# Altium project SynthyTwo.Project.PrjPcb
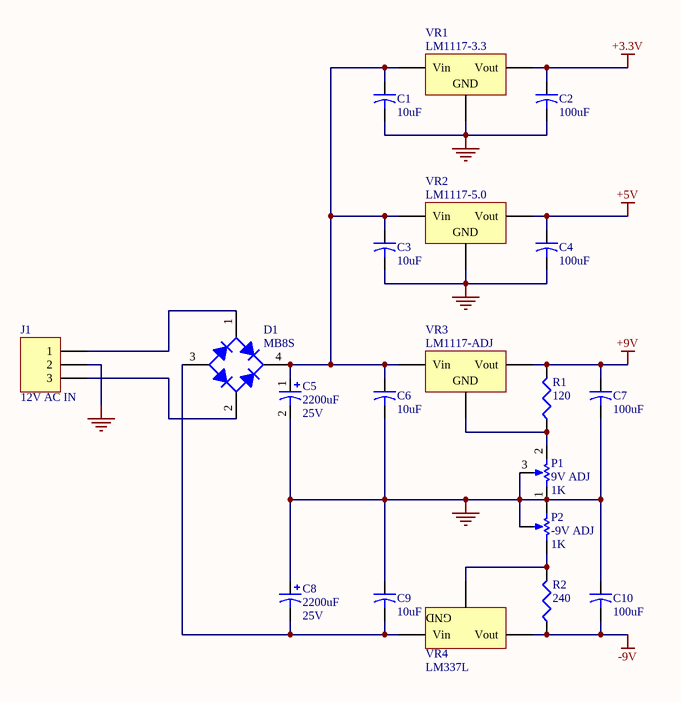
[diagram p0: PSU.Schematic.SchDoc]
7 sheets, 194 parts. Net scope: flat (ports and power ports of the same name join across sheets).
Board files: PCBROUTAGE.PcbDoc, PCBAdam.PcbDoc
Sheets:
  PSU.Schematic.SchDoc
  FilterBoard.Schematic.SchDoc
  Output.Schematic.SchDoc
  PIC.Schematic.SchDoc
  FilterControl.Schematic.SchDoc
  MIDI.Schematic.SchDoc
  Display.Schematic.SchDoc

## Sheet PSU.Schematic.SchDoc
size A

### Parts
C1  10uF  [CAPC1608N]
C2  100uF  [CAPC1608N]
C3  10uF  [CAPC1608N]
C4  100uF  [CAPC1608N]
C5  2200uF  value 25V  [Condo electro 13]
C6  10uF  [CAPC1608N]
C7  100uF  [CAPC1608N]
C8  2200uF  value 25V  [Condo electro 13]
C9  10uF  [CAPC1608N]
C10  100uF  [CAPC1608N]
D1  MB8S  [MB8S]
J1  12V AC IN  [HDR1X3]
P1  9V ADJ  value 1K  [BOURNS Trim pot]
P2  -9V ADJ  value 1K  [BOURNS Trim pot]
R1  120  [CAPC1608N]
R2  240  [CAPC1608N]
VR1  LM1117-3.3  [LM1117-SOT]
VR2  LM1117-5.0  [LM1117-SOT]
VR3  LM1117-ADJ  [LM1117-SOT]
VR4  LM337L  [LM337L]

### Nets
+3.3V: C2.1 VR1.3(Vout)
+5V: C4.1 VR2.3(Vout)
+9V: C7.1 R1.2 VR3.3(Vout)
-9V: C10.2 R2.1 VR4.3(Vout)
GND: C1.2 C2.2 C3.2 C4.2 C5.2 C6.2 C7.2 C8.1 C9.1 C10.1 J1.2 P1.1(TOP) P1.3(TAP) P2.2(BOT) P2.3(TAP) VR1.2(GND) VR2.2(GND)
NetC1_1: C1.1 C3.1 C5.1 C6.1 D1.4(K) VR1.1(Vin) VR2.1(Vin) VR3.1(Vin)
NetC8_2: C8.2 C9.2 D1.3(A) VR4.1(Vin)
NetD1_1: D1.1(C) J1.1
NetD1_2: D1.2(C) J1.3
NetP1_2: P1.2(BOT) R1.1 VR3.2(ADJ)
NetP2_1: P2.1(TOP) R2.2 VR4.2(ADJ)

### Notes on the sheet
- (in symbol Volt Reg) GND

### Library data of the parts
C1 C3 C6 C9 = Cap2: Capacitor; Value: 10u; Published: 23-Sep-2002; PackageReference: CAPR5-4X5; Publisher: Altium Limited; PackageDescription: Capacitor; 2 Leads
C2 C4 C7 C10 = Cap2: Capacitor; Value: 100u; Published: 23-Sep-2002; PackageReference: CAPR5-4X5; Publisher: Altium Limited; PackageDescription: Capacitor; 2 Leads
C5 C8 = Cap Pol1: Polarized Capacitor (Radial); Published: 8-Jun-2000; LatestRevisionDate: 17-Jul-2002; LatestRevisionNote: Re-released for DXP Platform.; PackageReference: RB7.6-15; Publisher: Altium Limited; PackageDescription: Polarized Capacitor (Radial); 2 Leads
D1 = Bridge1: Full Wave Diode Bridge; Fabricant: MULTICOMP; Published: 8-Jun-2000; LatestRevisionDate: 29-May-2009; LatestRevisionNote: Sch pins A & K swapped.; DatasheetVersion: E2732B; PackageReference: D-38; Publisher: Altium Limited; PackageDescription: Bridge Rectifier; 4 Terminals; Body 9.4 x 9.4 mm (typ); Pitch 5.08 mm; Datasheet: http://www.farnell.com/datasheets/1441729.pdf; Ref_Farnell: 1861520; Ref_Fabricant: MB8S
J1 = Header 3: Header, 3-Pin; Fabricant: Ideal Power; Ref_Fabricant: 77DE-06-12; LatestRevisionDate: 17-Jul-2002; LatestRevisionNote: Re-released for DXP Platform.; Publisher: Altium Limited; Datasheet: http://www.farnell.com/datasheets/1772938.pdf; Ref_Farnell: 2368013
P1 P2 = RPot: Potentiometer; Sim Note: Enter the Resistance value and the set point into parameter fields.; Set Position: 0.5; Published: 8-Jun-2000; LatestRevisionDate: 17-Jul-2002; LatestRevisionNote: Re-released for DXP Platform.; PackageReference: VR5; Publisher: Altium Limited; PackageDescription: Variable Resistor, Thru-Hole; 3 Leads
R1 R2 = Res3: Resistor; Published: 8-Jun-2000; LatestRevisionDate: 29-May-2009; LatestRevisionNote: IPC-7351 Footprint Added.; PackageReference: J1-0603; Publisher: Altium Limited; PackageDescription: Chip Resistor
  R1: Value: 120
  R2: Value: 240
VR1 = Volt Reg: Voltage Regulator; Ref_Fabricant: LM1117MPX-3.3/NOPB; Fabricant: Texas Instruments; Published: 24-Mar-1999; LatestRevisionDate: 29-May-2009; LatestRevisionNote: IPC-7351 Footprint Added.; PackageReference: D2PAK; Publisher: Altium Limited; PackageDescription: 3-Pin Transistor Outline Package 2.54 mm Pitch, 15.1 mm Lead Span; Ref_Farnell: 2323580; Datasheet: http://www.farnell.com/datasheets/2019100.pdf
VR2 = Volt Reg: Voltage Regulator; Ref_Fabricant: LM1117MPX-5.0/NOPB; Fabricant: Texas Instruments; Published: 24-Mar-1999; LatestRevisionDate: 29-May-2009; LatestRevisionNote: IPC-7351 Footprint Added.; PackageReference: D2PAK; Publisher: Altium Limited; PackageDescription: 3-Pin Transistor Outline Package 2.54 mm Pitch, 15.1 mm Lead Span; Datasheet: http://www.farnell.com/datasheets/2019100.pdf; Ref_Farnell: 2323572
VR3 = Volt Reg: Voltage Regulator; Published: 24-Mar-1999; LatestRevisionDate: 29-May-2009; LatestRevisionNote: IPC-7351 Footprint Added.; PackageReference: D2PAK; Publisher: Altium Limited; PackageDescription: 3-Pin Transistor Outline Package 2.54 mm Pitch, 15.1 mm Lead Span
VR4 = Volt Reg: Voltage Regulator; Fabricant: Texas Instruments; Ref_Fabricant: LM337LM/NOPB; Published: 24-Mar-1999; LatestRevisionDate: 29-May-2009; LatestRevisionNote: IPC-7351 Footprint Added.; PackageReference: D2PAK; Publisher: Altium Limited; PackageDescription: 3-Pin Transistor Outline Package 2.54 mm Pitch, 15.1 mm Lead Span; Ref_Farnell: 1469092; Datasheet: http://www.farnell.com/datasheets/1972825.pdf

## Sheet FilterBoard.Schematic.SchDoc
size B
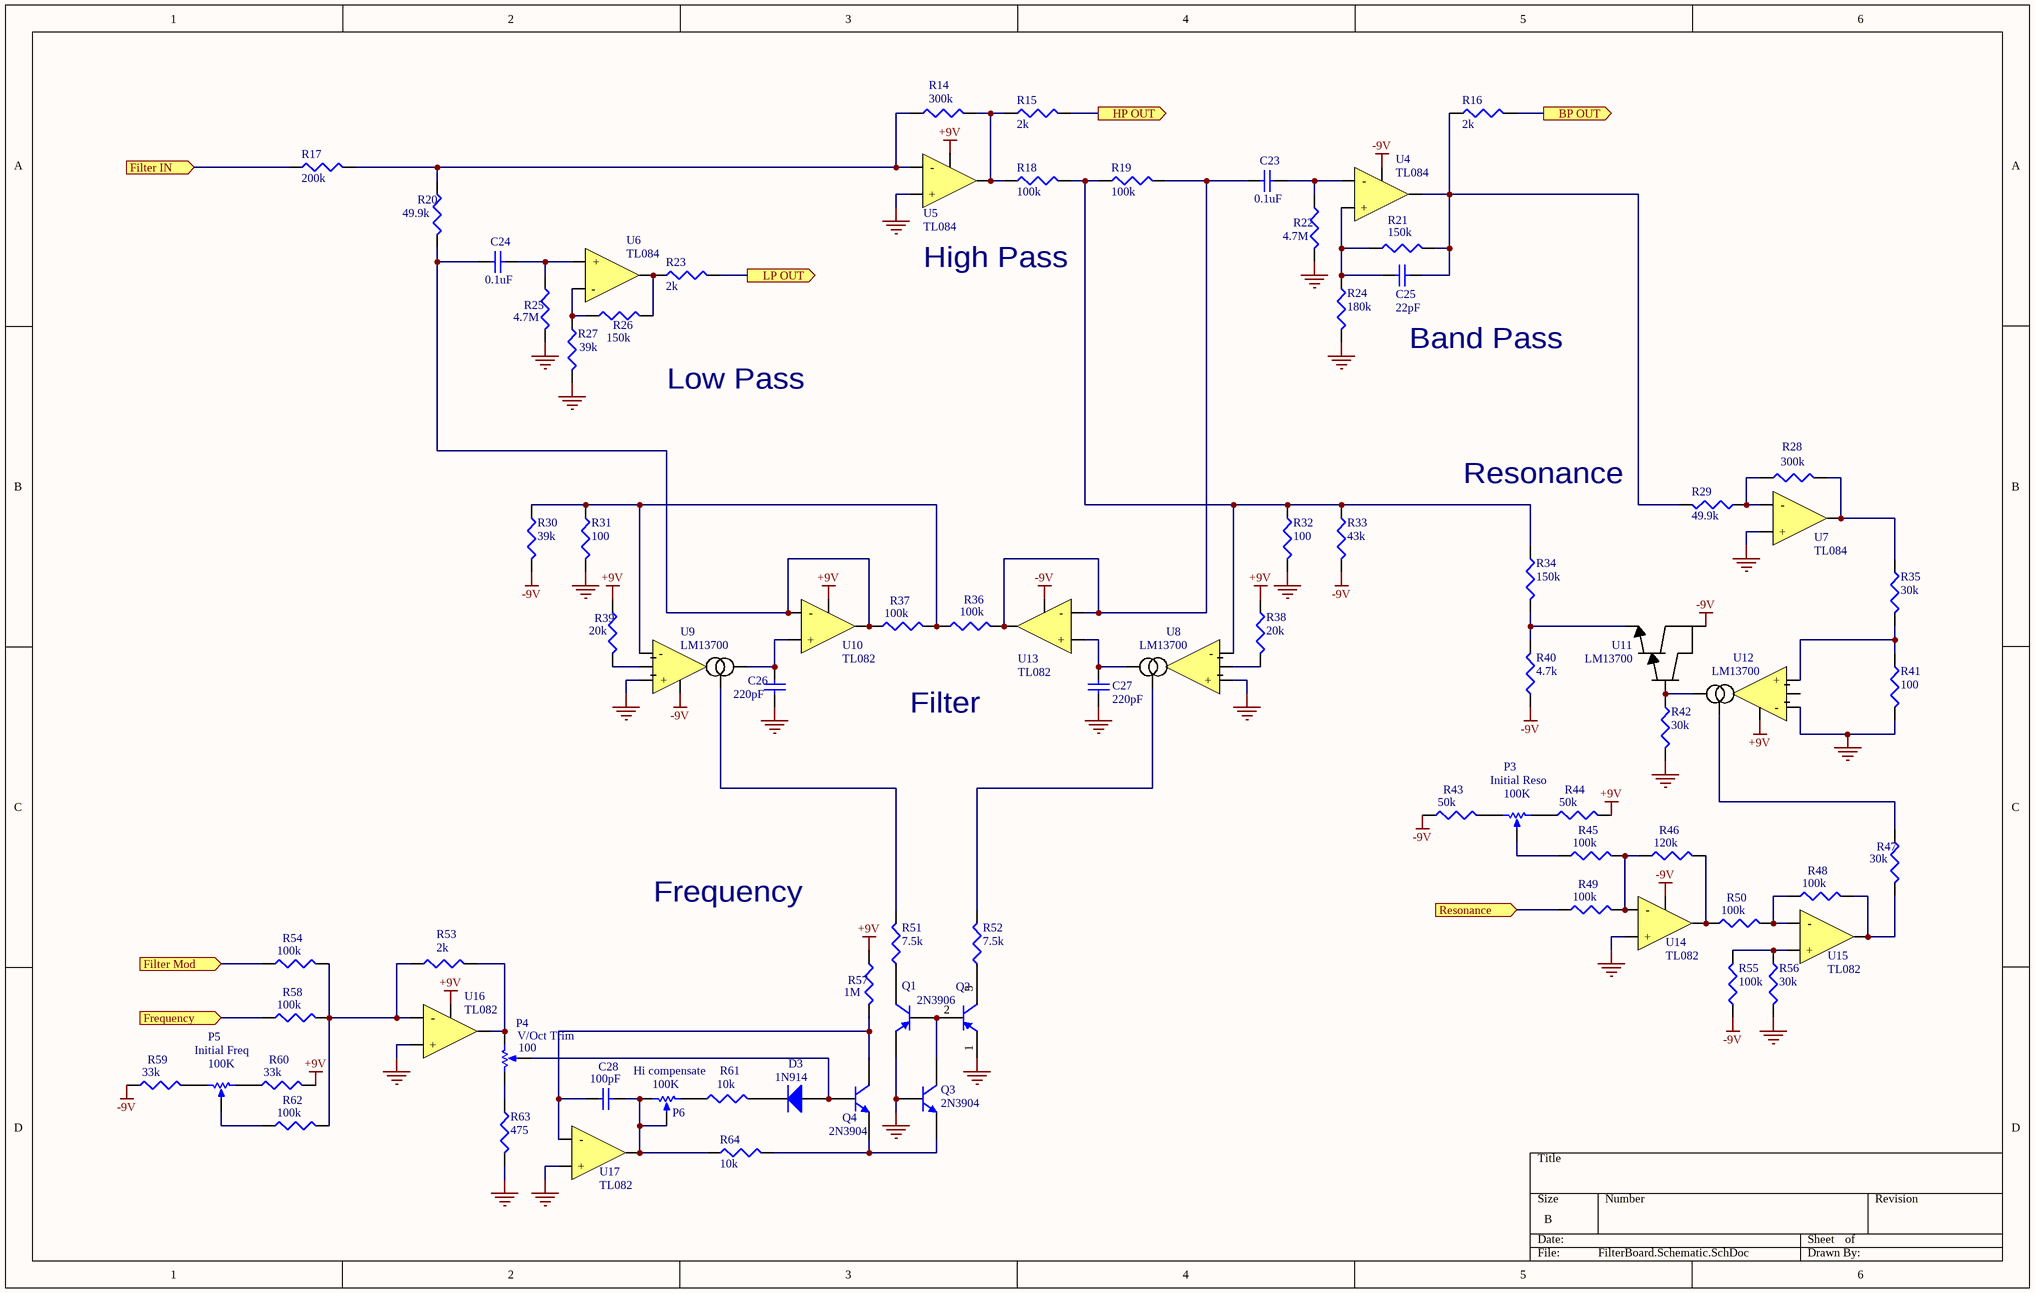
[diagram p1: FilterBoard.Schematic.SchDoc]

### Parts
C23  0.1uF  [CAPC1608N]
C24  0.1uF  [CAPC1608N]
C25  22pF  [CAPC1608N]
C26  220pF  [CAPC1608N]
C27  220pF  [CAPC1608N]
C28  100pF  [CAPC1608N]
D3  1N914  [1N914]
P3  Initial Reso  value 100K  [BOURNS Trim pot]
P4  V/Oct Trim  value 100  [BOURNS Trim pot]
P5  Initial Freq  value 100K  [BOURNS Trim pot]
P6  Hi compensate  value 100K  [BOURNS Trim pot]
Q1  2N3906  [2N3906]
Q2  2N3906  [2N3906]  (value not drawn)
Q3  2N3904  [2N3906]
Q4  2N3904  [2N3906]
R14  300k  [CAPC1608N]
R15  2k  [CAPC1608N]
R16  2k  [CAPC1608N]
R17  200k  [CAPC1608N]
R18  100k  [CAPC1608N]
R19  100k  [CAPC1608N]
R20  49.9k  [CAPC1608N]
R21  150k  [CAPC1608N]
R22  4.7M  [CAPC1608N]
R23  2k  [CAPC1608N]
R24  180k  [CAPC1608N]
R25  4.7M  [CAPC1608N]
R26  150k  [CAPC1608N]
R27  39k  [CAPC1608N]
R28  300k  [CAPC1608N]
R29  49.9k  [CAPC1608N]
R30  39k  [CAPC1608N]
R31  100  [CAPC1608N]
R32  100  [CAPC1608N]
R33  43k  [CAPC1608N]
R34  150k  [CAPC1608N]
R35  30k  [CAPC1608N]
R36  100k  [CAPC1608N]
R37  100k  [CAPC1608N]
R38  20k  [CAPC1608N]
R39  20k  [CAPC1608N]
R40  4.7k  [CAPC1608N]
R41  100  [CAPC1608N]
R42  30k  [CAPC1608N]
R43  50k  [CAPC1608N]
R44  50k  [CAPC1608N]
R45  100k  [CAPC1608N]
R46  120k  [CAPC1608N]
R47  30k  [CAPC1608N]
R48  100k  [CAPC1608N]
R49  100k  [CAPC1608N]
R50  100k  [CAPC1608N]
R51  7.5k  [CAPC1608N]
R52  7.5k  [CAPC1608N]
R53  2k  [CAPC1608N]
R54  100k  [CAPC1608N]
R55  100k  [CAPC1608N]
R56  30k  [CAPC1608N]
R57  1M  [CAPC1608N]
R58  100k  [CAPC1608N]
R59  33k  [CAPC1608N]
R60  33k  [CAPC1608N]
R61  10k  [CAPC1608N]
R62  100k  [CAPC1608N]
R63  475  [CAPC1608N]
R64  10k  [CAPC1608N]
U4  TL084  [TL084_3PADS+ALIM]
U5  TL084  [TL084_3PADS+ALIM]
U6  TL084  [TL084_3PADS]
U7  TL084  [TL084_3PADS]
U8  LM13700  [LM13700_5PADS]
U9  LM13700  [LM13700_5PADS+ALIM]
U10  TL082  [TL084_3PADS+ALIM]
U11  LM13700  [LM13700_3PADS]
U12  LM13700  [LM13700_5PADS+ALIM]
U13  TL082  [TL084_3PADS+ALIM]
U14  TL082  [TL084_3PADS+ALIM]
U15  TL082  [TL084_3PADS]
U16  TL082  [TL084_3PADS+ALIM]
U17  TL082  [TL084_3PADS]

### Ports
BP OUT (out), Filter IN (in), Filter Mod (in), Frequency (in), HP OUT (out), LP OUT (out), Resonance (in)

### Nets
+9V: R38.1 R39.1 R44.2 R57.1 R60.2 U5.4(VCC+) U10.4(VCC+) U12.6(VCC-) U16.4(VCC+)
-9V: R30.2 R33.2 R40.1 R43.1 R55.1 R59.1 U4.4(VCC+) U9.6(VCC-) U11.1(V+) U13.4(VCC+) U14.4(VCC+)
GND: C26.1 C27.1 Q1.1(E) Q2.1(E) Q3.2(B) R22.2 R24.2 R25.2 R27.2 R31.2 R32.2 R41.2 R42.2 R56.2 R63.2 U5.3(+) U7.3(+) U8.3(+) U9.3(+) U12.3(-) U14.3(+) U16.3(+) U17.3(+)
NetC23_1: C23.1 R19.2 R36.2 U13.1(OUT) U13.2(-)
NetC23_2: C23.2 R22.1 U4.2(-)
NetC24_1: C24.1 R20.2 R37.1 U10.1(OUT) U10.2(-)
NetC24_2: C24.2 R25.1 U6.3(+)
NetC25_1: C25.1 R21.1 R24.1 U4.3(+)
NetC25_2: C25.2 R16.1 R21.2 R29.2 U4.1(OUT)
NetC26_2: C26.2 U9.5(OUT) U10.3(+)
NetC27_2: C27.2 U8.5(OUT) U13.3(+)
NetC28_1: C28.1 Q4.3(C) R57.2 U17.2(-)
NetC28_2: C28.2 P6.2(BOT) P6.3(TAP) R64.1 U17.1(OUT)
NetD3_1: D3.1(A) P4.3(TAP) Q4.2(B)
NetD3_2: D3.2(K) R61.2
NetP3_1: P3.1(TOP) R44.1
NetP3_2: P3.2(BOT) R43.2
NetP3_3: P3.3(TAP) R45.1
NetP4_1: P4.1(TOP) R53.2 U16.1(OUT)
NetP4_2: P4.2(BOT) R63.1
NetP5_1: P5.1(TOP) R60.1
NetP5_2: P5.2(BOT) R59.2
NetP5_3: P5.3(TAP) R62.1
NetP6_1: P6.1(TOP) R61.1
NetQ1_2: Q1.2(B) Q2.2(B) Q3.3(C)
NetQ1_3: Q1.3(C) R51.1
NetQ2_3: Q2.3(C) R52.1
NetQ3_1: Q3.1(E) Q4.1(E) R64.2
NetR14_1: R14.1 R17.2 R20.1 U5.2(-)
NetR14_2: R14.2 R15.1 R18.1 U5.1(OUT)
NetR15_2: R15.2 ; port HP OUT
NetR16_2: R16.2 ; port BP OUT
NetR17_1: R17.1 ; port Filter IN
NetR18_2: R18.2 R19.1 R32.1 R33.1 R34.1 U8.4(-)
NetR23_1: R23.1 R26.2 U6.1(OUT)
NetR23_2: R23.2 ; port LP OUT
NetR26_1: R26.1 R27.1 U6.2(-)
NetR28_1: R28.1 R29.1 U7.2(-)
NetR28_2: R28.2 R35.1 U7.1(OUT)
NetR30_1: R30.1 R31.1 R36.1 R37.2 U9.4(-)
NetR34_2: R34.2 R40.2 U11.3(BOUT)
NetR35_2: R35.2 R41.1 U12.4(+)
NetR38_2: R38.2 U8.2
NetR39_2: R39.2 U9.2
NetR42_1: R42.1 U11.2(BIN) U12.5(OUT)
NetR45_2: R45.2 R46.1 R49.2 U14.2(-)
NetR46_2: R46.2 R50.1 U14.1(OUT)
NetR47_1: R47.1 U12.1(BIAS)
NetR47_2: R47.2 R48.2 U15.1(OUT)
NetR48_1: R48.1 R50.2 U15.2(-)
NetR49_1: R49.1 ; port Resonance
NetR51_2: R51.2 U9.1(BIAS)
NetR52_2: R52.2 U8.1(BIAS)
NetR53_1: R53.1 R54.2 R58.2 R62.2 U16.2(-)
NetR54_1: R54.1 ; port Filter Mod
NetR55_2: R55.2 R56.1 U15.3(+)
NetR58_1: R58.1 ; port Frequency

Not connected (* = marked no-connect by the designer): U12 2

### Notes on the sheet
- High Pass
- Band Pass
- Low Pass
- Resonance
- Filter
- Frequency

### Library data of the parts
C23 C24 = Cap Semi: Capacitor (Semiconductor SIM Model); Value: 0.1u; Published: 8-Jun-2000; LatestRevisionDate: 29-May-2009; LatestRevisionNote: IPC-7351 Footprint Added.; PackageReference: C1206; Publisher: Altium Limited; PackageDescription: Chip Capacitor
C25 = Cap Semi: Capacitor (Semiconductor SIM Model); Value: 22p; Published: 8-Jun-2000; LatestRevisionDate: 29-May-2009; LatestRevisionNote: IPC-7351 Footprint Added.; PackageReference: C1206; Publisher: Altium Limited; PackageDescription: Chip Capacitor
C26 C27 = Cap Semi: Capacitor (Semiconductor SIM Model); Value: 220p; Published: 8-Jun-2000; LatestRevisionDate: 29-May-2009; LatestRevisionNote: IPC-7351 Footprint Added.; PackageReference: C1206; Publisher: Altium Limited; PackageDescription: Chip Capacitor
C28 = Cap Semi: Capacitor (Semiconductor SIM Model); Value: 100p; Published: 8-Jun-2000; LatestRevisionDate: 29-May-2009; LatestRevisionNote: IPC-7351 Footprint Added.; PackageReference: C1206; Publisher: Altium Limited; PackageDescription: Chip Capacitor
D3 = Diode 1N4001: 1 Amp General Purpose Rectifier; Ref_Fabricant: 1N914BWT; Fabricant: Fairchild Semiconductor; Published: 8-Jun-2000; LatestRevisionDate: 17-Jul-2002; LatestRevisionNote: Re-released for DXP Platform.; DatasheetVersion: 1998; PackageVersion: Aug-1999; PackageReference: DO-41; Publisher: Altium Limited; PackageDescription: Diode, Axial; Body 5.2 x 2.7 mm (LxDia. max), Lead Dia. 0.86 mm (max); Code_JEDEC: DO-204-AL; ComponentLink1Description: Manufacturer Link; ComponentLink1URL: http://www.fairchildsemi.com/; ComponentLink2Description: Datasheet; ComponentLink2URL: http://www.fairchildsemi.com/ds/1N%2F1N4001.pdf; Ref_Farnell: 2453752; Datasheet: http://www.farnell.com/datasheets/1781082.pdf
P3-P6 = RPot: Potentiometer; Sim Note: Enter the Resistance value and the set point into parameter fields.; Set Position: 0.5; Fabricant: Bourns; Ref_Fabricant: 3362P-1-103LF; Published: 8-Jun-2000; LatestRevisionDate: 17-Jul-2002; LatestRevisionNote: Re-released for DXP Platform.; PackageReference: VR5; Publisher: Altium Limited; PackageDescription: Variable Resistor, Thru-Hole; 3 Leads; Datasheet: http://www.farnell.com/datasheets/2034958.pdf; Ref_Farnell: 9354301
Q1 Q2 = 2N3906: PNP General Purpose Amplifier; Ref_Fabricant: MMBT3906-7-F; Fabricant: Diodes INC.; Published: 8-Jun-2000; LatestRevisionDate: 15-Jan-2003; LatestRevisionNote: PCB Footprint 'BCY-W3/D4.7' replaced; DatasheetVersion: 1997; PackageVersion: Sep-1998; PackageReference: TO-92A; Publisher: Altium Limited; PackageDescription: TO, Flat Index; 3 In-Line, Axial Leads; Body Dia. 4.5mm; Leads 0.51 x 0.48 mm (max); ComponentLink1Description: Manufacturer Link; ComponentLink1URL: http://www.fairchildsemi.com/; ComponentLink2Description: Datasheet; ComponentLink2URL: http://www.fairchildsemi.com/ds/2N%2F2N3906.pdf; Datasheet: http://www.farnell.com/datasheets/1817590.pdf; Ref_Farnell: 1773629
Q3 Q4 = 2N3904: NPN General Purpose Amplifier; Fabricant: Diodes INC.; Ref_Fabricant: MMBT3904-7-F; Published: 8-Jun-2000; LatestRevisionDate: 15-Jan-2003; LatestRevisionNote: PCB Footprint 'BCY-W3/D4.7' replaced; DatasheetVersion: 1997; PackageVersion: Sep-1998; PackageReference: TO-92A; Publisher: Altium Limited; PackageDescription: TO, Flat Index; 3 In-Line, Axial Leads; Body Dia. 4.5mm; Leads 0.51 x 0.48 mm (max); ComponentLink1Description: Manufacturer Link; ComponentLink1URL: http://www.fairchildsemi.com/; ComponentLink2Description: Datasheet; ComponentLink2URL: http://www.fairchildsemi.com/ds/2N%2F2N3904.pdf; Ref_Farnell: 1773602; Datasheet: http://www.farnell.com/datasheets/1915516.pdf
R14-R64 = Res3: Resistor; Published: 8-Jun-2000; LatestRevisionDate: 29-May-2009; LatestRevisionNote: IPC-7351 Footprint Added.; PackageReference: J1-0603; Publisher: Altium Limited; PackageDescription: Chip Resistor
  R14 R28: Value: 300K
  R15 R16 R23 R53: Value: 2K
  R17: Value: 200K
  R18 R19 R36 R37 R45 R48-R50 R54 R55 R58 R62: Value: 100K
  R20 R29: Value: 49.9K
  R21 R26 R34: Value: 150K
  R22 R25: Value: 4.7M
  R24: Value: 180K
  R27 R30: Value: 39K
  R31 R32 R41: Value: 100
  R33: Value: 43K
  R35 R42 R47 R56: Value: 30K
  R38 R39: Value: 20K
  R40: Value: 4.7K
  R43 R44: Value: 50K
  R46: Value: 120K
  R51 R52: Value: 7.5K
  R57: Value: 1M
  R59 R60: Value: 33K
  R61 R64: Value: 10K
  R63: Value: 475
U6 U7 = TL084: Ref_Fabricant: TL084BCD; Fabricant: Fairshild Semiconductor; Ref_Farnell: 9593438; Datasheet: http://www.farnell.com/datasheets/1882473.pdf
U8 = LM13700_2: Ref_Fabricant: LM13700N/NOPB; Fabricant: Texas Instruments; Datasheet: http://www.farnell.com/datasheets/1851086.pdf
U9 U12 = LM13700: Ref_Fabricant: LM13700N/NOPB; Fabricant: Texas Instruments; Datasheet: http://www.farnell.com/datasheets/1851086.pdf; Ref_Farnell: 1468910
U10 U13-U17 = TL082: Ref_Fabricant: TL082ACD; Fabricant: Fairchild Semiconductor; Ref_Farnell: 2147256; Datasheet: http://www.farnell.com/datasheets/1965618.pdf
U11 = LM13700_1: Ref_Fabricant: LM13700N/NOPB; Fabricant: Texas Instruments; Datasheet: http://www.farnell.com/datasheets/1851086.pdf; Ref_Farnell: 1468910

## Sheet Output.Schematic.SchDoc
size A
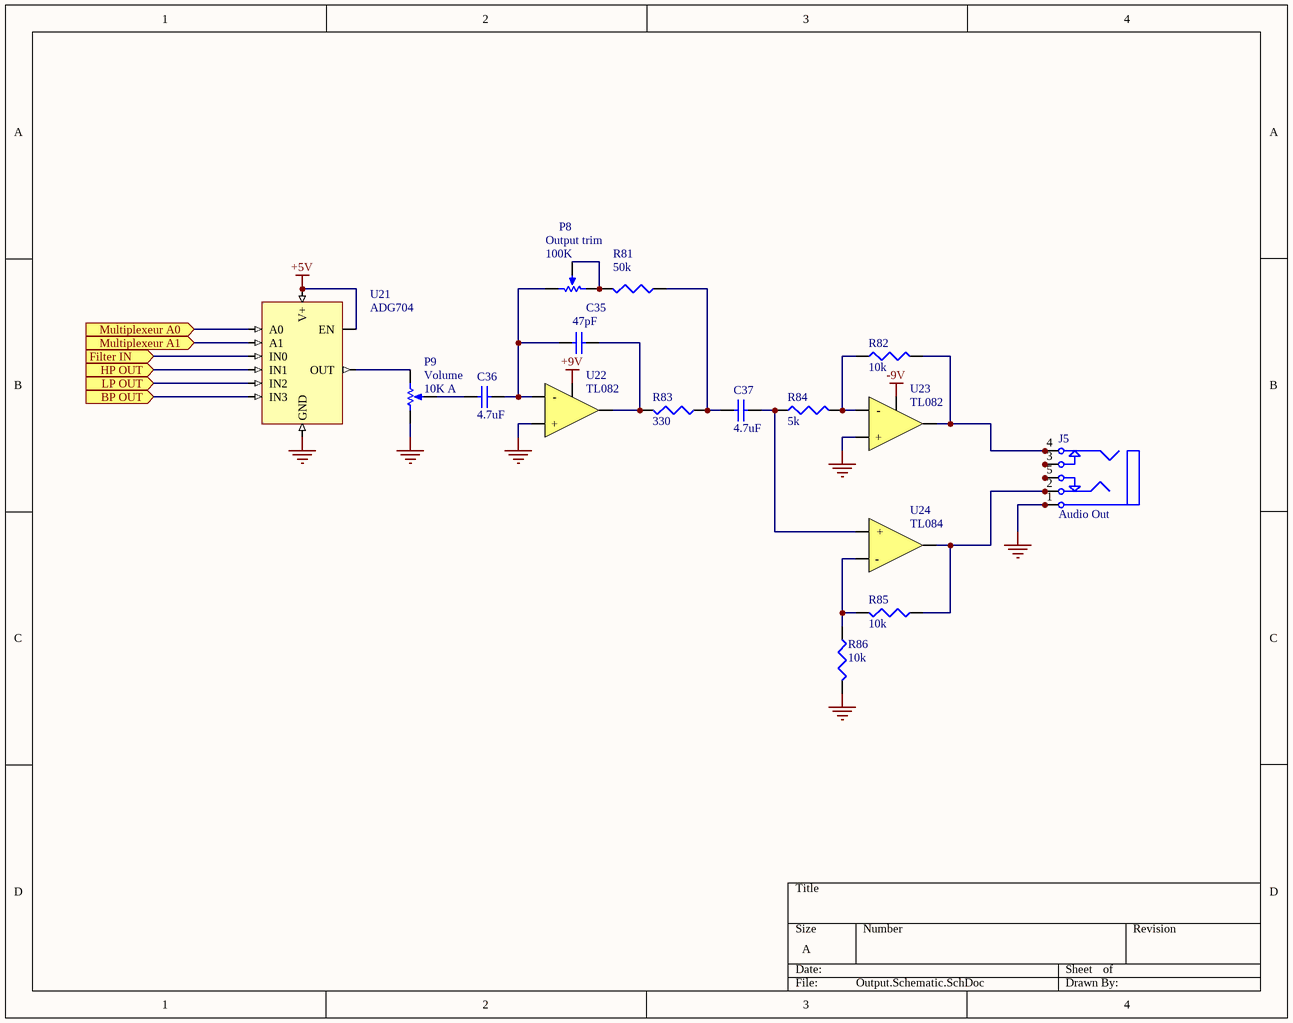
[diagram p2: Output.Schematic.SchDoc]

### Parts
C35  47pF  [CAPC1608N]
C36  4.7uF  [CAPC1608N]
C37  4.7uF  [CAPC1608N]
J5  Audio Out  [ST-3150-5N]
P8  Output trim  value 100K  [BOURNS Trim pot]
P9  Volume  value 10K A  [ALPS Potentiometer]
R81  50k  [CAPC1608N]
R82  10k  [CAPC1608N]
R83  330  [CAPC1608N]
R84  5k  [CAPC1608N]
R85  10k  [J1-0603]
R86  10k  [RESC6332]
U21  ADG704  [ADG704]
U22  TL082  [TL084_3PADS+ALIM]
U23  TL082  [TL084_3PADS+ALIM]
U24  TL084  [TL084_3PADS]

### Ports
BP OUT (in), Filter IN (in), HP OUT (in), LP OUT (in), Multiplexeur A0 (in), Multiplexeur A1 (in)

### Nets
+5V: U21.5(EN) U21.6(V+)
+9V: U22.4(VCC+)
-9V: U23.4(VCC+)
GND: J5.1 J5.1A J5.1B P9.1(TOP) R86.2 U21.3(GND) U22.3(+) U23.3(+)
NetC35_1: C35.1 C36.2 P8.1(TOP) U22.2(-)
NetC35_2: C35.2 R83.2 U22.1(OUT)
NetC36_1: C36.1 P9.3(TAP)
NetC37_1: C37.1 R81.1 R83.1
NetC37_2: C37.2 R84.1 U24.3(+)
NetJ5_2: J5.2 J5.2A J5.2B R85.1 U24.1(OUT)
NetJ5_3: J5.3 J5.3A J5.3B
NetJ5_4: J5.4 J5.4A J5.4B R82.2 U23.1(OUT)
NetJ5_5: J5.5 J5.5A J5.5B
NetP8_2: P8.2(BOT) P8.3(TAP) R81.2
NetP9_2: P9.2(BOT) U21.8(OUT)
NetR15_2: U21.9(IN1) ; port HP OUT
NetR16_2: U21.7(IN3) ; port BP OUT
NetR17_1: U21.2(IN0) ; port Filter IN
NetR23_2: U21.4(IN2) ; port LP OUT
NetR82_1: R82.1 R84.2 U23.2(-)
NetR85_2: R85.2 R86.1 U24.2(-)
NetU1_47: U21.10(A1) ; port Multiplexeur A1
NetU1_48: U21.1(A0) ; port Multiplexeur A0

### Library data of the parts
C35 = Cap Semi: Capacitor (Semiconductor SIM Model); Published: 8-Jun-2000; LatestRevisionDate: 29-May-2009; LatestRevisionNote: IPC-7351 Footprint Added.; PackageReference: C1206; Publisher: Altium Limited; PackageDescription: Chip Capacitor; Value: 47pF
C36 C37 = Cap Semi: Capacitor (Semiconductor SIM Model); Value: 4.7u; Published: 8-Jun-2000; LatestRevisionDate: 29-May-2009; LatestRevisionNote: IPC-7351 Footprint Added.; PackageReference: C1206; Publisher: Altium Limited; PackageDescription: Chip Capacitor
J5 = Phonejack Stereo SW: 3-Conductor Jack with 2 break contacts (normals) and 2 auxiliary make contacts; Published: 5-Jan-2004; LatestRevisionDate: 17-Dec-2003; LatestRevisionNote: PCB Footprint replaced.; DatasheetDocument: 07-Mar-2000; Publisher: Altium Limited; ComponentLink1Description: Manufacturer Link; ComponentLink1URL: http://domino.kycon.com/internet/Products.html
P8 = RPot: as P3 on sheet FilterBoard.Schematic; Published: 8-Jun-2000; LatestRevisionDate: 17-Jul-2002; LatestRevisionNote: Re-released for DXP Platform.; PackageReference: VR5; Publisher: Altium Limited; PackageDescription: Variable Resistor, Thru-Hole; 3 Leads; Datasheet: http://www.farnell.com/datasheets/2034958.pdf; Ref_Farnell: 9354301
P9 = RPot: Potentiometer; Sim Note: Enter the Resistance value and the set point into parameter fields.; Set Position: 0.5; Ref_Fabricant: RK09K1130C94; Fabricant: ALPS; Published: 8-Jun-2000; LatestRevisionDate: 17-Jul-2002; LatestRevisionNote: Re-released for DXP Platform.; PackageReference: VR5; Publisher: Altium Limited; PackageDescription: Variable Resistor, Thru-Hole; 3 Leads; Datasheet: http://www.farnell.com/datasheets/1718712.pdf; Ref_Farnell: 1191742
R81-R86 = Res3: Resistor; Published: 8-Jun-2000; LatestRevisionDate: 29-May-2009; LatestRevisionNote: IPC-7351 Footprint Added.; PackageReference: J1-0603; Publisher: Altium Limited; PackageDescription: Chip Resistor
  R81: Value: 50K
  R82 R85 R86: Value: 10K
  R83: Value: 330
  R84: Value: 5K
U21 = ADG704: Ref_Fabricant: MC100EP57DTG; Fabricant: On Semiconductor; Datasheet: http://www.farnell.com/datasheets/1915143.pdf; Ref_Farnell: 1468710
U22 U23 = TL082: as U10 on sheet FilterBoard.Schematic; Ref_Farnell: 2147256; Datasheet: http://www.farnell.com/datasheets/1965618.pdf
U24 = TL084: as U6 on sheet FilterBoard.Schematic; Ref_Farnell: 9593438; Datasheet: http://www.farnell.com/datasheets/1882473.pdf

## Sheet PIC.Schematic.SchDoc
size A
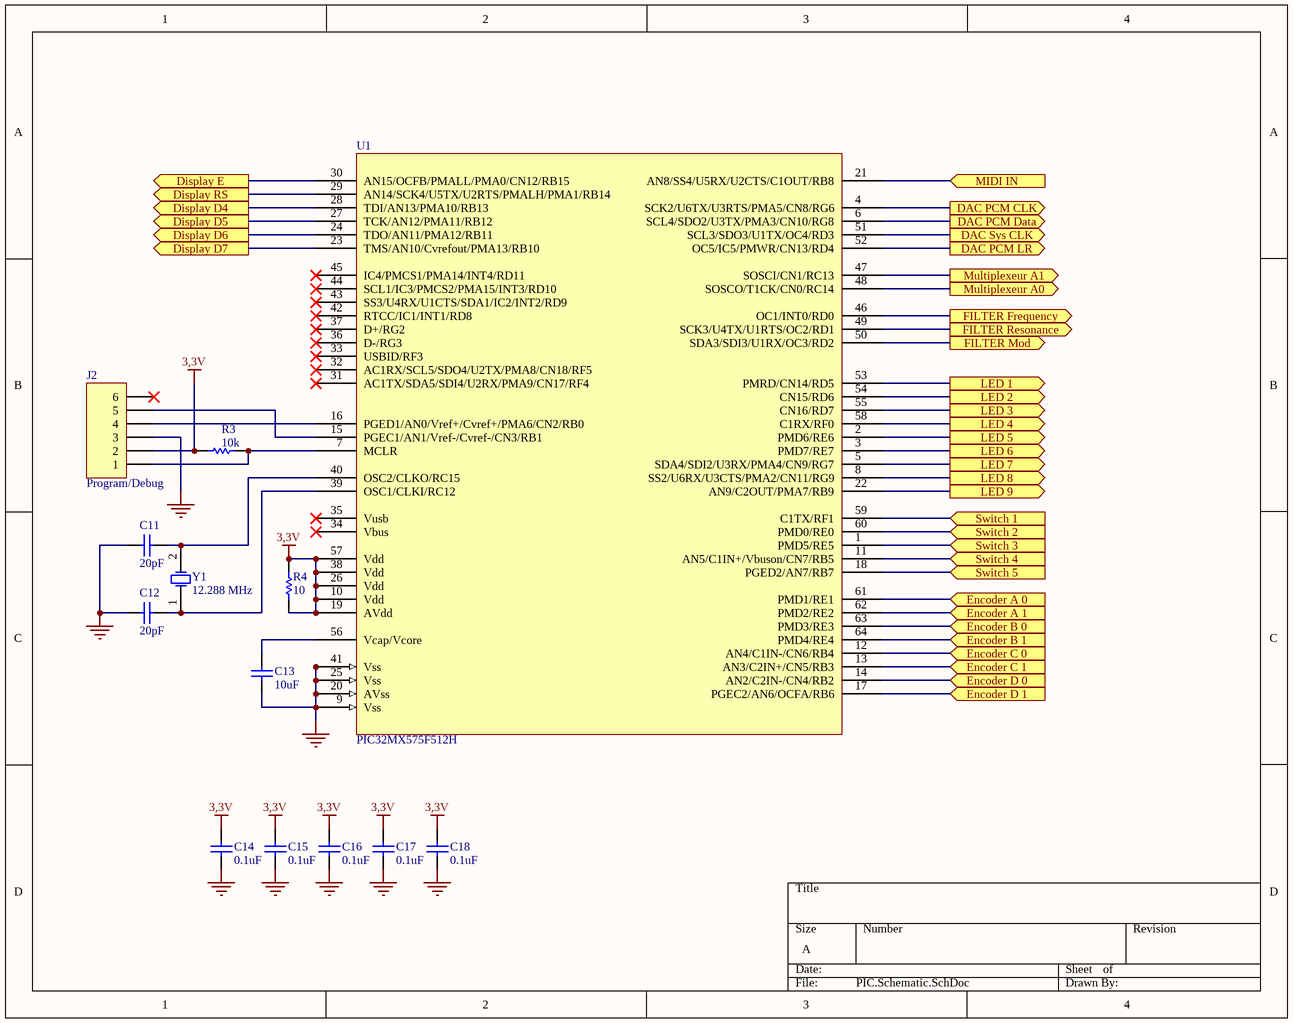
[diagram p3: PIC.Schematic.SchDoc]

### Parts
C11  20pF  [CAPC1608N]
C12  20pF  [CAPC1608N]
C13  10uF  [RAD-0.3]
C14  0.1uF  [CAPC1608N]
C15  0.1uF  [CAPC1608N]
C16  0.1uF  [CAPC1608N]
C17  0.1uF  [CAPC1608N]
C18  0.1uF  [CAPC1608N]
J2  Program/Debug  [RJ11]
R3  10k  [CAPC1608N]
R4  10  [CAPC1608N]
U1  PIC32MX575F512H  [PIC32]
Y1  12.288 MHz  [Xtal]

### Ports
DAC PCM CLK (out), DAC PCM Data (out), DAC PCM LR (out), DAC Sys CLK (out), Display D4 (out), Display D5 (out), Display D6 (out), Display D7 (out), Display E (out), Display RS (out), Encoder A 0 (in), Encoder A 1 (in), Encoder B 0 (in), Encoder B 1 (in), Encoder C 0 (in), Encoder C 1 (in), Encoder D 0 (in), Encoder D 1 (in), FILTER Frequency (out), FILTER Mod (out), FILTER Resonance (out), LED 1 (out), LED 2 (out), LED 3 (out), LED 4 (out), LED 5 (out), LED 6 (out), LED 7 (out), LED 8 (out), LED 9 (out), MIDI IN (in), Multiplexeur A0 (out), Multiplexeur A1 (out), Switch 1 (in), Switch 2 (in), Switch 3 (in), Switch 4 (in), Switch 5 (in)

### Nets
3,3V: C14.2 C15.2 C16.2 C17.2 C18.2 J2.2 R3.2 R4.1 R4.2 U1.10(Vdd) U1.19(AVdd) U1.26(Vdd) U1.38(Vdd) U1.57(Vdd)
GND: C11.1 C12.1 C13.1 C14.1 C15.1 C16.1 C17.1 C18.1 J2.3 U1.9(Vss) U1.20(AVss) U1.25(Vss) U1.41(Vss)
NetC11_2: C11.2 U1.40(OSC2/CLKO/RC15) Y1.2(OSC2)
NetC12_2: C12.2 U1.39(OSC1/CLKI/RC12) Y1.1(OSC1)
NetC13_2: C13.2 U1.56(Vcap/Vcore)
NetJ2_1: J2.1 R3.1 U1.7(MCLR)
NetJ2_4: J2.4 U1.16(PGED1/AN0/Vref+/Cvref+/PMA6/CN2/RB0)
NetJ2_5: J2.5 U1.15(PGEC1/AN1/Vref-/Cvref-/CN3/RB1)
NetR7_1: U1.21(AN8/SS4/U5RX/U2CTS/C1OUT/RB8) ; port MIDI IN
NetR54_1: U1.50(SDA3/SDI3/U1RX/OC3/RD2) ; port FILTER Mod
NetR66_1: U1.46(OC1/INT0/RD0) ; port FILTER Frequency
NetR72_1: U1.49(SCK3/U4TX/U1RTS/OC2/RD1) ; port FILTER Resonance
NetR87_1: U1.53(PMRD/CN14/RD5) ; port LED 1
NetR88_1: U1.54(CN15/RD6) ; port LED 2
NetR89_1: U1.55(CN16/RD7) ; port LED 3
NetR90_1: U1.18(PGED2/AN7/RB7) ; port Switch 5
NetR91_1: U1.11(AN5/C1IN+/Vbuson/CN7/RB5) ; port Switch 4
NetR92_1: U1.1(PMD5/RE5) ; port Switch 3
NetR93_1: U1.60(PMD0/RE0) ; port Switch 2
NetR94_1: U1.59(C1TX/RF1) ; port Switch 1
NetR95_1: U1.58(C1RX/RF0) ; port LED 4
NetR96_1: U1.2(PMD6/RE6) ; port LED 5
NetR97_1: U1.3(PMD7/RE7) ; port LED 6
NetR98_1: U1.5(SDA4/SDI2/U3RX/PMA4/CN9/RG7) ; port LED 7
NetR99_1: U1.8(SS2/U6RX/U3CTS/PMA2/CN11/RG9) ; port LED 8
NetR100_1: U1.22(AN9/C2OUT/PMA7/RB9) ; port LED 9
NetU1_4: U1.4(SCK2/U6TX/U3RTS/PMA5/CN8/RG6) ; port DAC PCM CLK
NetU1_6: U1.6(SCL4/SDO2/U3TX/PMA3/CN10/RG8) ; port DAC PCM Data
NetU1_12: U1.12(AN4/C1IN-/CN6/RB4) ; port Encoder C 0
NetU1_13: U1.13(AN3/C2IN+/CN5/RB3) ; port Encoder C 1
NetU1_14: U1.14(AN2/C2IN-/CN4/RB2) ; port Encoder D 0
NetU1_17: U1.17(PGEC2/AN6/OCFA/RB6) ; port Encoder D 1
NetU1_23: U1.23(TMS/AN10/Cvrefout/PMA13/RB10) ; port Display D7
NetU1_24: U1.24(TDO/AN11/PMA12/RB11) ; port Display D6
NetU1_27: U1.27(TCK/AN12/PMA11/RB12) ; port Display D5
NetU1_28: U1.28(TDI/AN13/PMA10/RB13) ; port Display D4
NetU1_29: U1.29(AN14/SCK4/U5TX/U2RTS/PMALH/PMA1/RB14) ; port Display RS
NetU1_30: U1.30(AN15/OCFB/PMALL/PMA0/CN12/RB15) ; port Display E
NetU1_47: U1.47(SOSCI/CN1/RC13) ; port Multiplexeur A1
NetU1_48: U1.48(SOSCO/T1CK/CN0/RC14) ; port Multiplexeur A0
NetU1_51: U1.51(SCL3/SDO3/U1TX/OC4/RD3) ; port DAC Sys CLK
NetU1_52: U1.52(OC5/IC5/PMWR/CN13/RD4) ; port DAC PCM LR
NetU1_61: U1.61(PMD1/RE1) ; port Encoder A 0
NetU1_62: U1.62(PMD2/RE2) ; port Encoder A 1
NetU1_63: U1.63(PMD3/RE3) ; port Encoder B 0
NetU1_64: U1.64(PMD4/RE4) ; port Encoder B 1

Not connected (* = marked no-connect by the designer): J2 6*; U1 31(AC1TX/SDA5/SDI4/U2RX/PMA9/CN17/RF4)* 32(AC1RX/SCL5/SDO4/U2TX/PMA8/CN18/RF5)* 33(USBID/RF3)* 34(Vbus)* 35(Vusb)* 36(D-/RG3)* 37(D+/RG2)* 42(RTCC/IC1/INT1/RD8)* 43(SS3/U4RX/U1CTS/SDA1/IC2/INT2/RD9)* 44(SCL1/IC3/PMCS2/PMA15/INT3/RD10)* 45(IC4/PMCS1/PMA14/INT4/RD11)*

### Library data of the parts
C11 C12 = Cap Semi: Capacitor (Semiconductor SIM Model); Value: 20p; Published: 8-Jun-2000; LatestRevisionDate: 29-May-2009; LatestRevisionNote: IPC-7351 Footprint Added.; PackageReference: C1206; Publisher: Altium Limited; PackageDescription: Chip Capacitor
C13 = Cap: Capacitor; Published: 8-Jun-2000; LatestRevisionDate: 17-Jul-2002; LatestRevisionNote: Re-released for DXP Platform.; PackageReference: RAD-0.3; Publisher: Altium Limited; PackageDescription: Radial Cap, Thru-Hole; 2 Leads; 0.3 in Pin Spacing; Value: 10uF
C14-C18 = Cap Semi: as C23 on sheet FilterBoard.Schematic; Published: 8-Jun-2000; LatestRevisionDate: 29-May-2009; LatestRevisionNote: IPC-7351 Footprint Added.; PackageReference: C1206; Publisher: Altium Limited; PackageDescription: Chip Capacitor
J2 = Header 6H: Header, 6-Pin, Right Angle; Ref_Fabricant: 615006138521; Fabricant: Würth Elektronik; LatestRevisionDate: 17-Jul-2002; LatestRevisionNote: Re-released for DXP Platform.; Publisher: Altium Limited; Datasheet: http://www.farnell.com/datasheets/76611.pdf; Ref_Farnell: 1642041
R3 = Res1: Resistor; Published: 8-Jun-2000; LatestRevisionDate: 17-Jul-2002; LatestRevisionNote: Re-released for DXP Platform.; PackageReference: AXIAL-0.3; Publisher: Altium Limited; PackageDescription: Axial Device, Thru-Hole; 2 Leads; 0.3 in Pin Spacing; Value: 10K
R4 = Res1: Resistor; Value: 10R; Published: 8-Jun-2000; LatestRevisionDate: 17-Jul-2002; LatestRevisionNote: Re-released for DXP Platform.; PackageReference: AXIAL-0.3; Publisher: Altium Limited; PackageDescription: Axial Device, Thru-Hole; 2 Leads; 0.3 in Pin Spacing
U1 = PIC32 MX575F512H: Ref_Fabricant: PIC32MX575F512H-80I/PT; Fabricant: Microship; Ref_Farnell: 1778958; Datasheet: http://www.farnell.com/datasheets/1506142.pdf
Y1 = XTAL: Crystal Oscillator; Ref_Fabricant: FOXSLF/128-20; Fabricant: Fox Electronic; Published: 8-Jun-2000; LatestRevisionDate: 17-Jul-2002; LatestRevisionNote: Re-released for DXP Platform.; PackageReference: R38; Publisher: Altium Limited; PackageDescription: Crystal, Thru-Hole; 2 Leads; Body 3.1 x 8.2 mm (Dia.xH); Datasheet: http://www.farnell.com/datasheets/1911270.pdf; Ref_Farnell: 2063995

## Sheet FilterControl.Schematic.SchDoc
size A
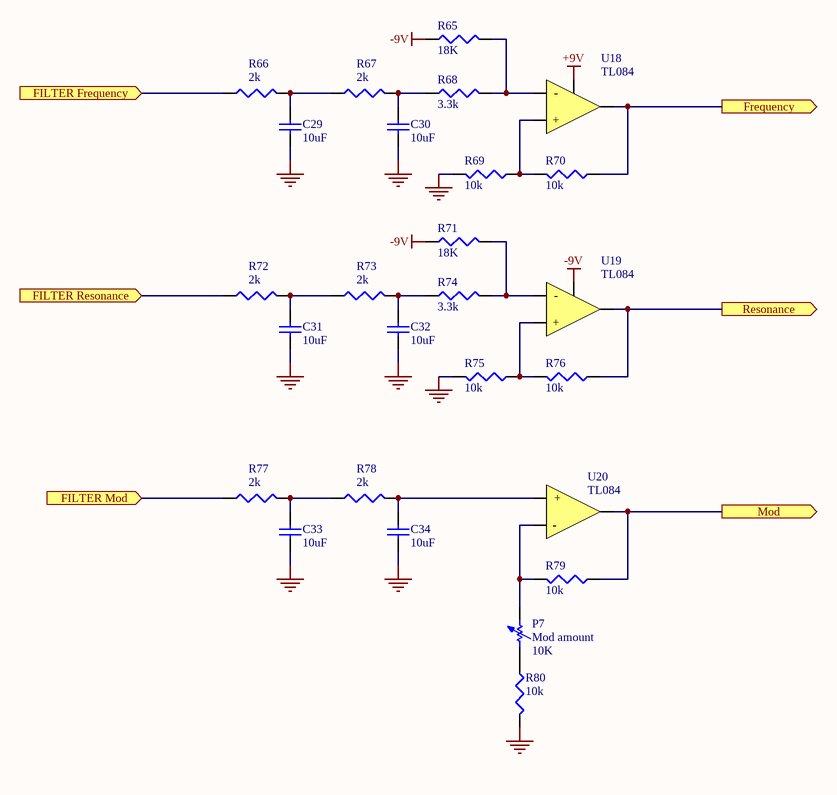
[diagram p4: FilterControl.Schematic.SchDoc]

### Parts
C29  10uF  [CAPC1608N]
C30  10uF  [CAPC1608N]
C31  10uF  [CAPC1608N]
C32  10uF  [CAPC1608N]
C33  10uF  [CAPC1608N]
C34  10uF  [CAPC1608N]
P7  Mod amount  value 10K  [AXIAL-0.7]
R65  18K  [CAPC1608N]
R66  2k  [CAPC1608N]
R67  2k  [CAPC1608N]
R68  3.3k  [CAPC1608N]
R69  10k  [CAPC1608N]
R70  10k  [CAPC1608N]
R71  18K  [CAPC1608N]
R72  2k  [CAPC1608N]
R73  2k  [CAPC1608N]
R74  3.3k  [CAPC1608N]
R75  10k  [CAPC1608N]
R76  10k  [CAPC1608N]
R77  2k  [CAPC1608N]
R78  2k  [CAPC1608N]
R79  10k  [CAPC1608N]
R80  10k  [CAPC1608N]
U18  TL084  [TL084_3PADS+ALIM]
U19  TL084  [TL084_3PADS+ALIM]
U20  TL084  [TL084_3PADS]

### Ports
FILTER Frequency (in), FILTER Mod (in), FILTER Resonance (in), Frequency (out), Mod (out), Resonance (out)

### Nets
+9V: U18.4(VCC+)
-9V: R65.1 R71.1 U19.4(VCC+)
GND: C29.1 C30.1 C31.1 C32.1 C33.1 C34.1 R69.2 R75.2 R80.2
NetC29_2: C29.2 R66.2 R67.1
NetC30_2: C30.2 R67.2 R68.1
NetC31_2: C31.2 R72.2 R73.1
NetC32_2: C32.2 R73.2 R74.1
NetC33_2: C33.2 R77.2 R78.1
NetC34_2: C34.2 R78.2 U20.3(+)
NetP7_1: P7.1 R80.1
NetP7_2: P7.2 R79.2 U20.2(-)
NetR49_1: R76.1 U19.1(OUT) ; port Resonance
NetR54_1: R77.1 ; port FILTER Mod
NetR58_1: R70.1 U18.1(OUT) ; port Frequency
NetR65_2: R65.2 R68.2 U18.2(-)
NetR66_1: R66.1 ; port FILTER Frequency
NetR69_1: R69.1 R70.2 U18.3(+)
NetR71_2: R71.2 R74.2 U19.2(-)
NetR72_1: R72.1 ; port FILTER Resonance
NetR75_1: R75.1 R76.2 U19.3(+)
NetR79_1: R79.1 U20.1(OUT) ; port Mod

### Library data of the parts
C29-C34 = Cap Semi: Capacitor (Semiconductor SIM Model); Value: 10u; Published: 8-Jun-2000; LatestRevisionDate: 29-May-2009; LatestRevisionNote: IPC-7351 Footprint Added.; PackageReference: C1206; Publisher: Altium Limited; PackageDescription: Chip Capacitor
P7 = Res Adj1: Variable Resistor; Set Position: 0.5; Published: 8-Jun-2000; LatestRevisionDate: 17-Jul-2002; LatestRevisionNote: Re-released for DXP Platform.; PackageReference: AXIAL-0.7; Publisher: Altium Limited; PackageDescription: Axial Device, Thru-Hole; 2 Leads; 0.7 in Pin Spacing
R65-R80 = Res3: Resistor; Published: 8-Jun-2000; LatestRevisionDate: 29-May-2009; LatestRevisionNote: IPC-7351 Footprint Added.; PackageReference: J1-0603; Publisher: Altium Limited; PackageDescription: Chip Resistor
  R65 R71: Value: 18K
  R66 R67 R72 R73 R77 R78: Value: 2K
  R68 R74: Value: 3.3K
  R69 R70 R75 R76 R79 R80: Value: 10K
U18-U20 = TL084: Ref_Fabricant: TL084BCD; Fabricant: Fairchild Semiconductor; Datasheet: http://www.farnell.com/datasheets/1882473.pdf; Ref_Farnell: 9593438

## Sheet MIDI.Schematic.SchDoc
size A
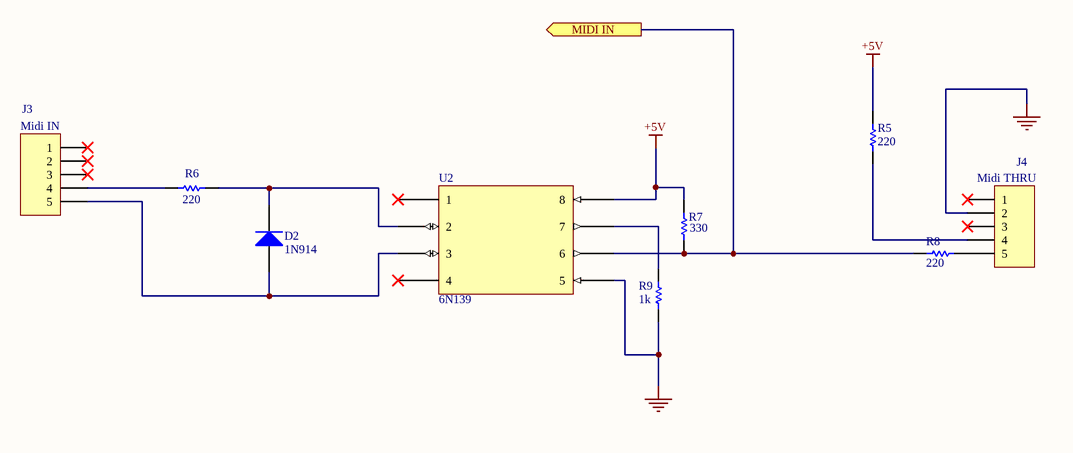
[diagram p5: MIDI.Schematic.SchDoc]

### Parts
D2  1N914  [1N914]
J3  Midi IN  [SOCKET MIDI]
J4  Midi THRU  [SOCKET MIDI]
R5  value 220  [CAPC1608N]  (hidden comment: Res1)
R6  value 220  [CAPC1608N]  (hidden comment: Res1)
R7  330  [CAPC1608N]
R8  value 220  [CAPC1608N]  (hidden comment: Res1)
R9  1k  [CAPC1608N]
U2  6N139  [6N139]

### Ports
MIDI IN (out)

### Nets
+5V: R5.2 R7.2 U2.8
GND: J4.2 R9.1 U2.5
NetD2_1: D2.1(A) J3.5 U2.3
NetD2_2: D2.2(K) R6.2 U2.2
NetJ3_4: J3.4 R6.1
NetJ4_4: J4.4 R5.1
NetJ4_5: J4.5 R8.1
NetR7_1: R7.1 R8.2 U2.6 ; port MIDI IN
NetR9_2: R9.2 U2.7

Not connected (* = marked no-connect by the designer): J3 1* 2* 3*; J4 1* 3*; U2 1* 4*

### Library data of the parts
D2 = Diode: Default Diode; Ref_Fabricant: 1N914BWT; Fabricant: Fairshild Semiconductor; Published: 8-Jun-2000; LatestRevisionDate: 17-Jul-2002; LatestRevisionNote: Re-released for DXP Platform.; PackageVersion: Sep-1996; PackageReference: SMC; Publisher: Altium Limited; PackageDescription: DO-214-AB/SMC; 2 C-Bend Leads; Body 7.9 x 5.9 mm, inc. leads (LxW); Code_JEDEC: DO-214-AB; Ref_Farnell: 2453752; Datasheet: http://www.farnell.com/datasheets/1781082.pdf
J3 J4 = Header 5: DIN 5 Pins; Ref_Fabricant: PSG03463; Fabricant: PRO SIGNAL; LatestRevisionDate: 17-Jul-2002; LatestRevisionNote: Re-released for DXP Platform.; Publisher: Altium Limited; Datasheet: http://www.farnell.com/datasheets/1697491.pdf; Ref_Farnell: 1791756
R5-R9 = Res1: Resistor; Published: 8-Jun-2000; LatestRevisionDate: 17-Jul-2002; LatestRevisionNote: Re-released for DXP Platform.; PackageReference: AXIAL-0.3; Publisher: Altium Limited; PackageDescription: Axial Device, Thru-Hole; 2 Leads; 0.3 in Pin Spacing
  R7: Value: 330
  R9: Value: 1K
U2 = Optocoupleur: Ref_Fabricant: 6N139-300E; Fabricant: Broadcom Limited; Datasheet: http://www.farnell.com/datasheets/1266261.pdf; Ref_Farnell: 1085023

## Sheet Display.Schematic.SchDoc
size A
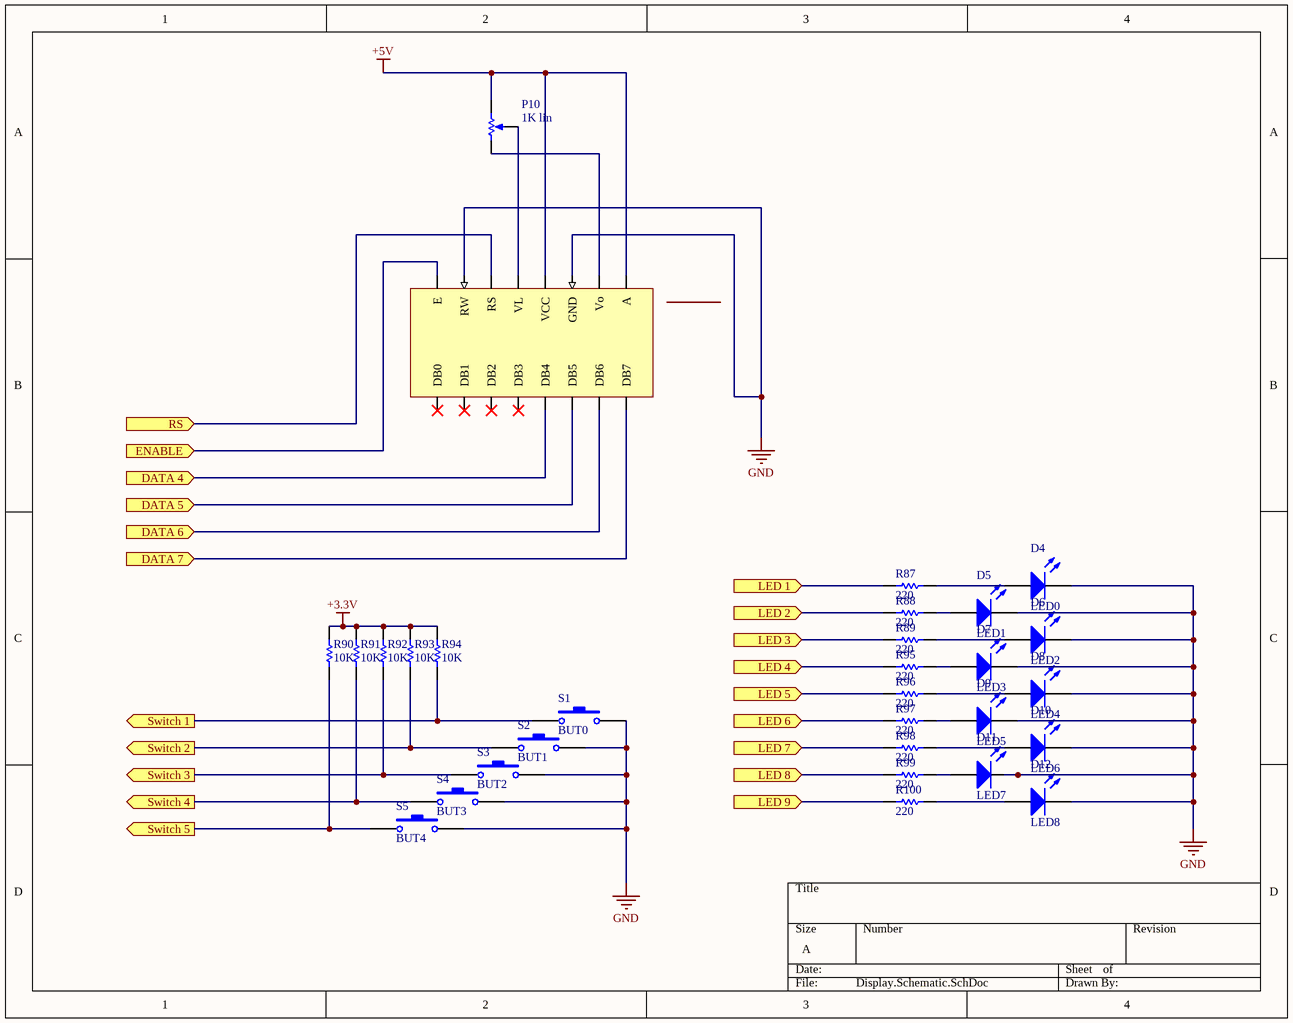
[diagram p6: Display.Schematic.SchDoc]

### Parts
D4  LED0  [LED]
D5  LED1  [LED]
D6  LED2  [LED]
D7  LED3  [LED]
D8  LED4  [LED]
D9  LED5  [LED]
D10  LED6  [LED]
D11  LED7  [LED]
D12  LED8  [LED]
Display1  16x2 LCD  [Display]  (value not drawn)
P10  1K lin  [BOURNS Trim pot]
R87  220  [CAPC1608N]
R88  220  [CAPC1608N]
R89  220  [CAPC1608N]
R90  10K  [CAPC1608N]
R91  10K  [CAPC1608N]
R92  10K  [CAPC1608N]
R93  10K  [CAPC1608N]
R94  10K  [CAPC1608N]
R95  220  [CAPC1608N]
R96  220  [CAPC1608N]
R97  220  [CAPC1608N]
R98  220  [CAPC1608N]
R99  220  [CAPC1608N]
R100  220  [CAPC1608N]
S1  BUT0  [PUSH BUTTON]
S2  BUT1  [PUSH BUTTON]
S3  BUT2  [PUSH BUTTON]
S4  BUT3  [PUSH BUTTON]
S5  BUT4  [PUSH BUTTON]

### Ports
DATA 4 (in), DATA 5 (in), DATA 6 (in), DATA 7 (in), ENABLE (in), LED 1 (in), LED 2 (in), LED 3 (in), LED 4 (in), LED 5 (in), LED 6 (in), LED 7 (in), LED 8 (in), LED 9 (in), RS (in), Switch 1 (out), Switch 2 (out), Switch 3 (out), Switch 4 (out), Switch 5 (out)

### Nets
+3.3V: R90.2 R91.2 R92.2 R93.2 R94.2
+5V: Display1.2(VCC) Display1.16(A) P10.2(BOT)
GND: D4.2(K) D5.2(K) D6.2(K) D7.2(K) D8.2(K) D9.2(K) D10.2(K) D11.2(K) D12.2(K) Display1.1(GND) Display1.5(RW) S1.2 S2.2 S3.2 S4.2 S5.2
NetD4_1: D4.1(A) R87.2
NetD5_1: D5.1(A) R88.2
NetD6_1: D6.1(A) R89.2
NetD7_1: D7.1(A) R95.2
NetD8_1: D8.1(A) R96.2
NetD9_1: D9.1(A) R97.2
NetD10_1: D10.1(A) R98.2
NetD11_1: D11.1(A) R99.2
NetD12_1: D12.1(A) R100.2
NetDisplay1_3: Display1.3(VL) P10.3(TAP)
NetDisplay1_4: Display1.4(RS) ; port RS
NetDisplay1_6: Display1.6(E) ; port ENABLE
NetDisplay1_7: Display1.7(DB7) ; port DATA 7
NetDisplay1_8: Display1.8(DB6) ; port DATA 6
NetDisplay1_9: Display1.9(DB5) ; port DATA 5
NetDisplay1_10: Display1.10(DB4) ; port DATA 4
NetDisplay1_15: Display1.15(Vo) P10.1(TOP)
NetR87_1: R87.1 ; port LED 1
NetR88_1: R88.1 ; port LED 2
NetR89_1: R89.1 ; port LED 3
NetR90_1: R90.1 S5.1 ; port Switch 5
NetR91_1: R91.1 S4.1 ; port Switch 4
NetR92_1: R92.1 S3.1 ; port Switch 3
NetR93_1: R93.1 S2.1 ; port Switch 2
NetR94_1: R94.1 S1.1 ; port Switch 1
NetR95_1: R95.1 ; port LED 4
NetR96_1: R96.1 ; port LED 5
NetR97_1: R97.1 ; port LED 6
NetR98_1: R98.1 ; port LED 7
NetR99_1: R99.1 ; port LED 8
NetR100_1: R100.1 ; port LED 9

Not connected (* = marked no-connect by the designer): Display1 11(DB3)* 12(DB2)* 13(DB1)* 14(DB0)*

### Library data of the parts
D4-D12 = LED0: Typical INFRARED GaAs LED; Ref_Fabricant: DX1119/RD; Fabricant: BULGIN; Published: 8-Jun-2000; LatestRevisionDate: 08-Jul-2005; LatestRevisionNote: Mech Layer 1 removed.; PackageReference: LED-0; Publisher: Altium Limited; PackageDescription: LED; 2 Leads; Ref_Farnell: 170585; Datasheet: http://www.farnell.com/datasheets/308331.pdf
Display1 = Display: Ref_Fabricant: MC21605G12W-VNMLR; Fabricant: Midas; Ref_Farnell: 2483338; Datasheet: http://www.farnell.com/datasheets/1934366.pdf
P10 = RPot: Potentiometer; Sim Note: Enter the Resistance value and the set point into parameter fields.; Set Position: 0.5; Value: 10K; Ref_Fabricant: 3362P-1-103LF; Fabricant: Bourns; Published: 8-Jun-2000; LatestRevisionDate: 17-Jul-2002; LatestRevisionNote: Re-released for DXP Platform.; PackageReference: VR5; Publisher: Altium Limited; PackageDescription: Variable Resistor, Thru-Hole; 3 Leads; Ref_Farnell: 9354301; Datasheet: http://www.farnell.com/datasheets/2034958.pdf
R87 R88 R90-R94 = Res1: Resistor; Value: 1K; Published: 8-Jun-2000; LatestRevisionDate: 17-Jul-2002; LatestRevisionNote: Re-released for DXP Platform.; PackageReference: AXIAL-0.3; Publisher: Altium Limited; PackageDescription: Axial Device, Thru-Hole; 2 Leads; 0.3 in Pin Spacing
R89 R95-R100 = Res1: Resistor; Published: 8-Jun-2000; LatestRevisionDate: 17-Jul-2002; LatestRevisionNote: Re-released for DXP Platform.; PackageReference: AXIAL-0.3; Publisher: Altium Limited; PackageDescription: Axial Device, Thru-Hole; 2 Leads; 0.3 in Pin Spacing; Value: 220
S1-S5 = SW-PB: Switch; Ref_Fabricant: TS0A22; Fabricant: MULTICOMP; Published: 24-Mar-1999; LatestRevisionDate: 17-Jul-2002; LatestRevisionNote: Re-released for DXP Platform.; PackageReference: SPST-2; Publisher: Altium Limited; PackageDescription: Switch; 2 Leads; Datasheet: http://www.farnell.com/datasheets/1662238.pdf; Ref_Farnell: 1550253

## Nets that join several sheets
+3.3V: PSU.Schematic (C2.1 VR1.3), Display.Schematic (5 pins)
+5V: PSU.Schematic (C4.1 VR2.3), Output.Schematic (U21.5 U21.6), MIDI.Schematic (R5.2 R7.2 U2.8), Display.Schematic (Display1.2 Display1.16 P10.2)
+9V: PSU.Schematic (C7.1 R1.2 VR3.3), FilterBoard.Schematic (9 pins), Output.Schematic (U22.4), FilterControl.Schematic (U18.4)
-9V: PSU.Schematic (C10.2 R2.1 VR4.3), FilterBoard.Schematic (11 pins), Output.Schematic (U23.4), FilterControl.Schematic (R65.1 R71.1 U19.4)
GND: PSU.Schematic (17 pins), FilterBoard.Schematic (23 pins), Output.Schematic (8 pins), PIC.Schematic (13 pins), FilterControl.Schematic (9 pins), MIDI.Schematic (J4.2 R9.1 U2.5), Display.Schematic (16 pins)
NetR7_1: PIC.Schematic (U1.21), MIDI.Schematic (R7.1 R8.2 U2.6)
NetR15_2: FilterBoard.Schematic (R15.2), Output.Schematic (U21.9)
NetR16_2: FilterBoard.Schematic (R16.2), Output.Schematic (U21.7)
NetR17_1: FilterBoard.Schematic (R17.1), Output.Schematic (U21.2)
NetR23_2: FilterBoard.Schematic (R23.2), Output.Schematic (U21.4)
NetR49_1: FilterBoard.Schematic (R49.1), FilterControl.Schematic (R76.1 U19.1)
NetR54_1: FilterBoard.Schematic (R54.1), PIC.Schematic (U1.50), FilterControl.Schematic (R77.1)
NetR58_1: FilterBoard.Schematic (R58.1), FilterControl.Schematic (R70.1 U18.1)
NetR66_1: PIC.Schematic (U1.46), FilterControl.Schematic (R66.1)
NetR72_1: PIC.Schematic (U1.49), FilterControl.Schematic (R72.1)
NetR87_1: PIC.Schematic (U1.53), Display.Schematic (R87.1)
NetR88_1: PIC.Schematic (U1.54), Display.Schematic (R88.1)
NetR89_1: PIC.Schematic (U1.55), Display.Schematic (R89.1)
NetR90_1: PIC.Schematic (U1.18), Display.Schematic (R90.1 S5.1)
NetR91_1: PIC.Schematic (U1.11), Display.Schematic (R91.1 S4.1)
NetR92_1: PIC.Schematic (U1.1), Display.Schematic (R92.1 S3.1)
NetR93_1: PIC.Schematic (U1.60), Display.Schematic (R93.1 S2.1)
NetR94_1: PIC.Schematic (U1.59), Display.Schematic (R94.1 S1.1)
NetR95_1: PIC.Schematic (U1.58), Display.Schematic (R95.1)
NetR96_1: PIC.Schematic (U1.2), Display.Schematic (R96.1)
NetR97_1: PIC.Schematic (U1.3), Display.Schematic (R97.1)
NetR98_1: PIC.Schematic (U1.5), Display.Schematic (R98.1)
NetR99_1: PIC.Schematic (U1.8), Display.Schematic (R99.1)
NetR100_1: PIC.Schematic (U1.22), Display.Schematic (R100.1)
NetU1_47: Output.Schematic (U21.10), PIC.Schematic (U1.47)
NetU1_48: Output.Schematic (U21.1), PIC.Schematic (U1.48)